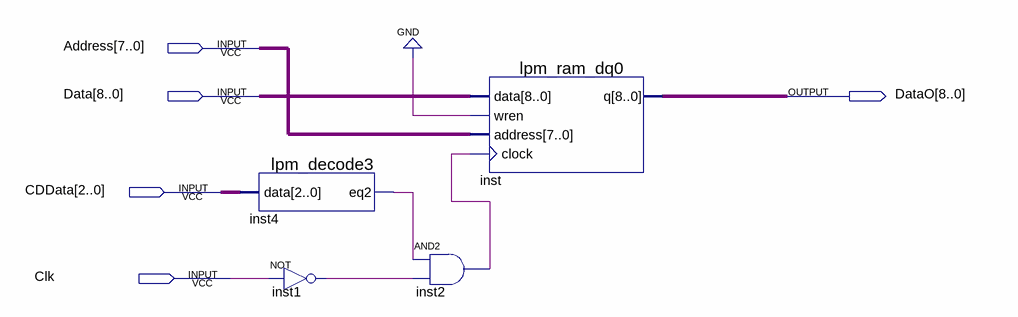
[diagram p0: schematic sheet]
// Quartus schematic RAM.bdf as structural Verilog: 4 symbols, 5 pins
module RAM (
  input  [7:0] Address,
  input  [8:0] Data,
  input  [2:0] CDData,
  input  Clk,
  output [8:0] DataO
);

  wire inst1_out, inst2_out, inst4_eq2;

  lpm_decode3 inst4 (.data(CDData), .eq2(inst4_eq2));
  not inst1 (inst1_out, Clk);
  and inst2 (inst2_out, inst4_eq2, inst1_out);
  lpm_ram_dq0 inst (.data(Data), .wren(1'b0), .address(Address), .clock(inst2_out), .q(DataO));
endmodule
